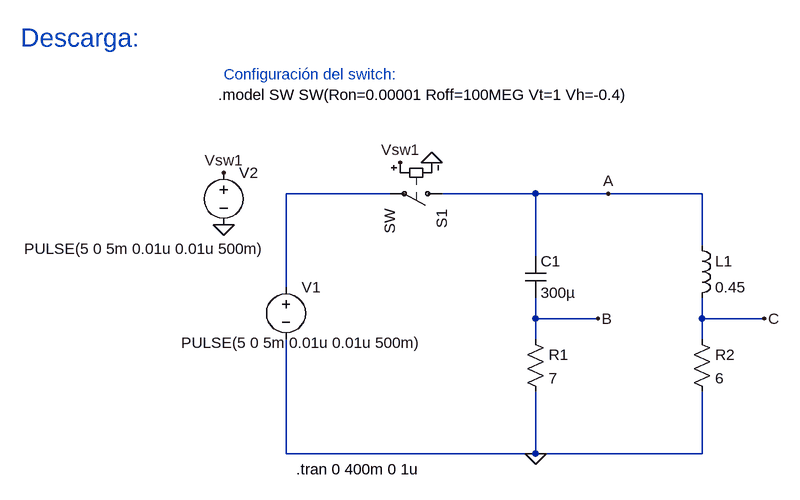
[diagram p0: schematic Etapa_Descarga.asc]
Etapa_Descarga.asc, the LTspice schematic file:
Version 4
SHEET 1 880 680
WIRE -192 -80 -352 -80
WIRE 32 -80 -112 -80
WIRE 144 -80 32 -80
WIRE 288 -80 144 -80
WIRE 288 0 288 -80
WIRE 32 16 32 -80
WIRE -352 64 -352 -80
WIRE 32 112 32 80
WIRE 128 112 32 112
WIRE 288 112 288 80
WIRE 384 112 288 112
WIRE 32 144 32 112
WIRE 288 144 288 112
WIRE -352 320 -352 144
WIRE 32 320 32 224
WIRE 32 320 -352 320
WIRE 288 320 288 224
WIRE 288 320 32 320
FLAG 32 320 0
FLAG 144 -80 A
FLAG 128 112 B
FLAG 384 112 C
FLAG -128 -128 0
FLAG -448 -32 0
FLAG -448 -112 Vsw1
FLAG -176 -128 Vsw1
SYMBOL res 16 128 R0
SYMATTR InstName R1
SYMATTR Value 7
SYMBOL res 272 128 R0
SYMATTR InstName R2
SYMATTR Value 6
SYMBOL cap 16 16 R0
SYMATTR InstName C1
SYMATTR Value 300µ
SYMBOL ind 272 -16 R0
SYMATTR InstName L1
SYMATTR Value 0.45
SYMBOL voltage -352 48 R0
WINDOW 3 -161 101 Left 2
WINDOW 123 0 0 Left 0
WINDOW 39 0 0 Left 0
SYMATTR Value PULSE(5 0 5m 0.01u 0.01u 500m)
SYMATTR InstName V1
SYMBOL sw -96 -80 R90
SYMATTR InstName S1
SYMBOL voltage -448 -128 R0
WINDOW 3 -307 133 Left 2
WINDOW 123 0 0 Left 0
WINDOW 39 0 0 Left 0
SYMATTR InstName V2
SYMATTR Value PULSE(5 0 5m 0.01u 0.01u 500m)
TEXT -336 344 Left 2 !.tran 0 400m 0 1u
TEXT -456 -232 Left 2 !.model SW SW(Ron=0.00001 Roff=100MEG Vt=1 Vh=-0.4)
TEXT -448 -264 Left 2 ;Configuración del switch:
TEXT -760 -320 Left 4 ;Descarga:

The netlist it stands for:
* Etapa_Descarga.asc
R1 B 0 7
R2 C 0 6
C1 A B 300µ
L1 A C 0.45
V1 N001 0 PULSE(5 0 5m 0.01u 0.01u 500m)
S1 A N001 Vsw1 0 SW
V2 Vsw1 0 PULSE(5 0 5m 0.01u 0.01u 500m)
.tran 0 400m 0 1u
.model SW SW(Ron=0.00001 Roff=100MEG Vt=1 Vh=-0.4)
* Configuración del switch:
* Descarga:
.backanno
.end